# EAGLE design G785E (EAGLE 6.6.0)
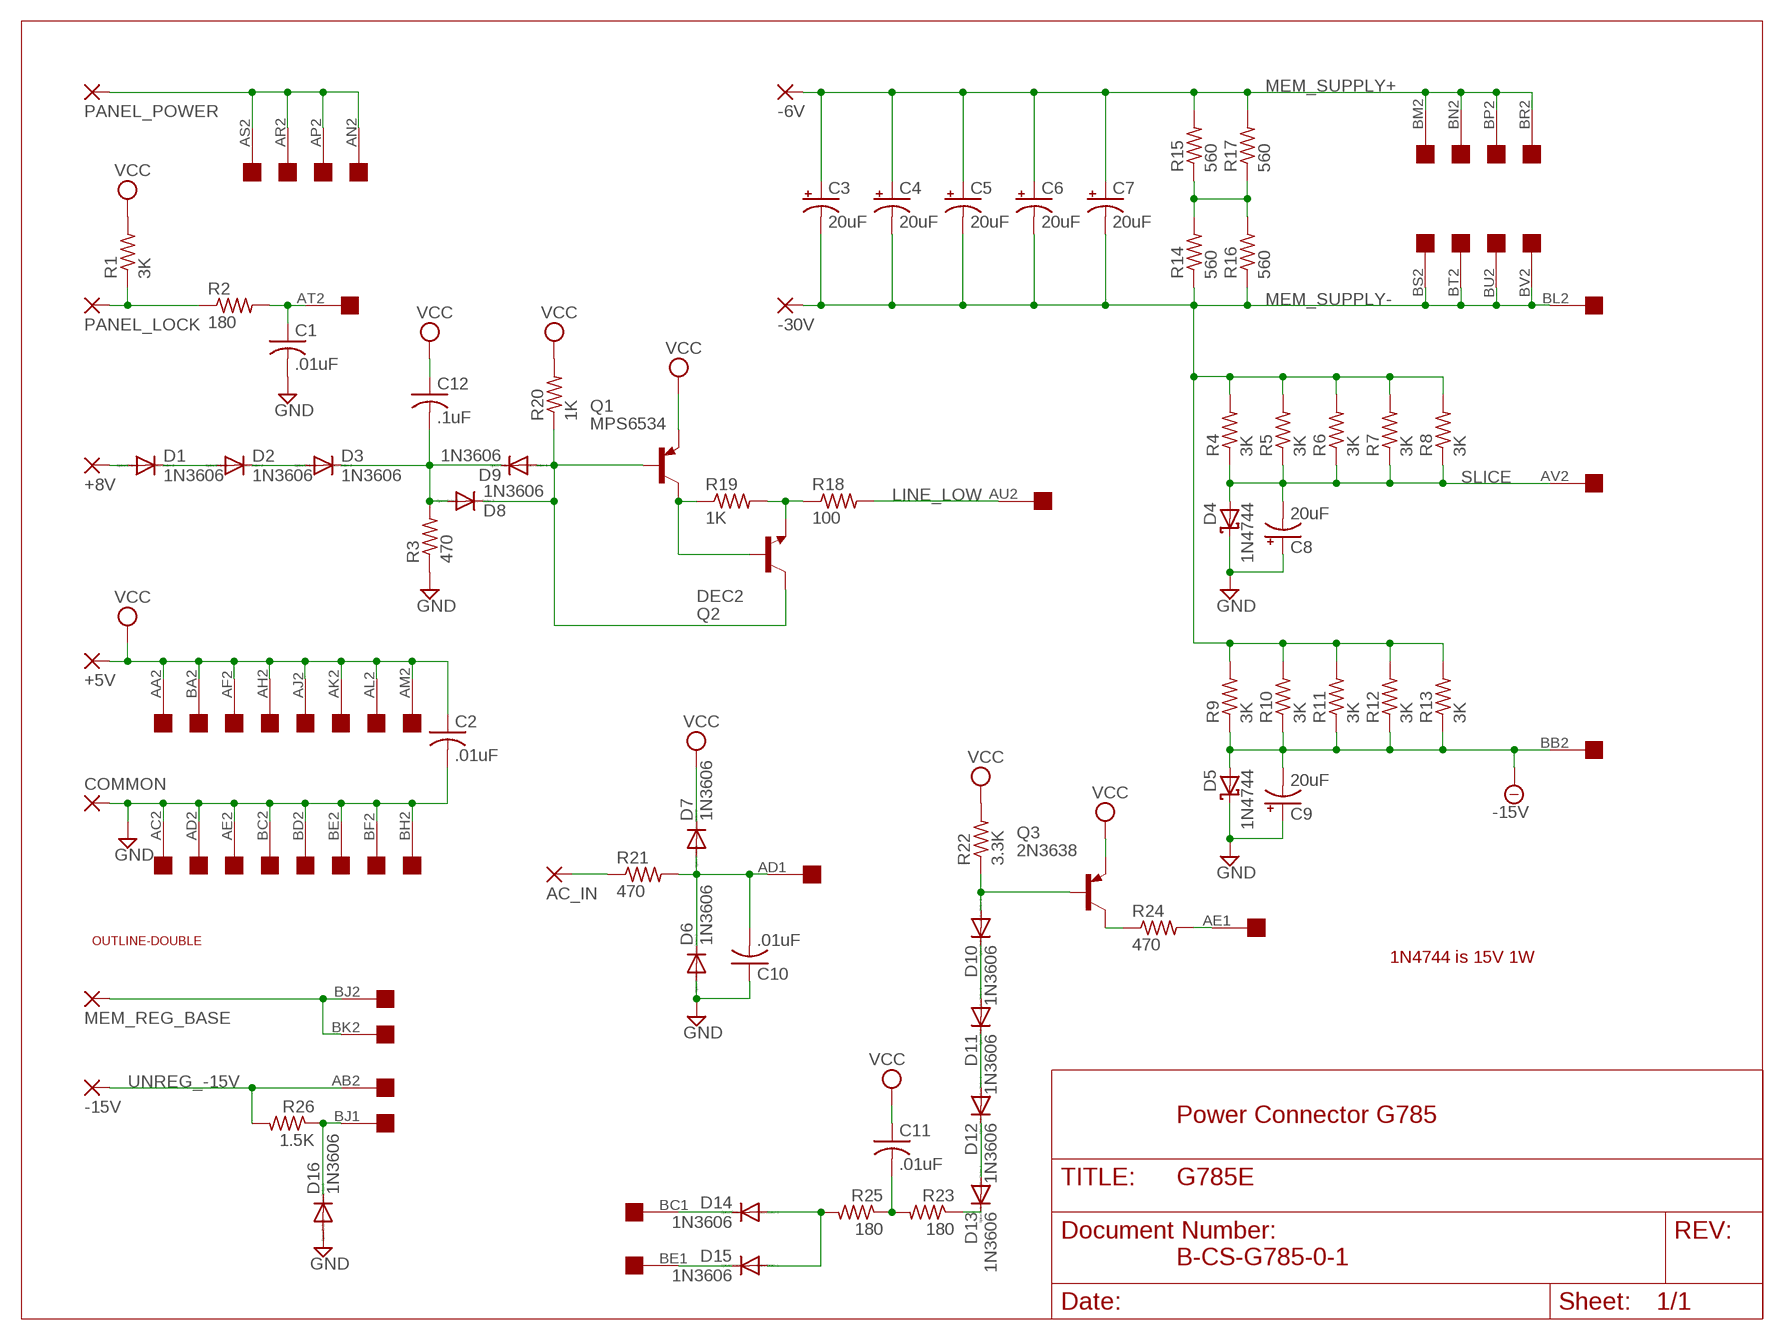
[diagram p0: schematic, sheet 1]

## Parts
+5V  3,81/1,4  [3,81/1,4]
+8V  3,81/1,4  [3,81/1,4]
-6V  3,81/1,4  [3,81/1,4]
-15V  3,81/1,4  [3,81/1,4]
-30V  3,81/1,4  [3,81/1,4]
AC_IN  3,81/1,4  [3,81/1,4]
C1  .01uF  C-US050-025X075  [C050-025X075]
C2  .01uF  C-US050-025X075  [C050-025X075]
C3  20uF  CPOL-USE25-9AXIAL  [E25-9]
C4  20uF  CPOL-USE25-9AXIAL  [E25-9]
C5  20uF  CPOL-USE25-9AXIAL  [E25-9]
C6  20uF  CPOL-USE25-9AXIAL  [E25-9]
C7  20uF  CPOL-USE25-9AXIAL  [E25-9]
C8  20uF  CPOL-USE25-9AXIAL  [E25-9]
C9  20uF  CPOL-USE25-9AXIAL  [E25-9]
C10  .01uF  C-US050-025X075  [C050-025X075]
C11  .01uF  C-US050-025X075  [C050-025X075]
C12  .1uF  C-US102-043X133  [C102-043X133]
COMMON  3,81/1,4  [3,81/1,4]
D1  1N3606  1N4148DO35-10  [DO35-10]
D2  1N3606  1N4148DO35-10  [DO35-10]
D3  1N3606  1N4148DO35-10  [DO35-10]
D4  1N4744  BAT42  [DO35-10]
D5  1N4744  BAT42  [DO35-10]
D6  1N3606  1N4148DO35-10  [DO35-10]
D7  1N3606  1N4148DO35-10  [DO35-10]
D8  1N3606  1N4148DO35-10  [DO35-10]
D9  1N3606  1N4148DO35-10  [DO35-10]
D10  1N3606  1N4148DO35-10  [DO35-10]
D11  1N3606  1N4148DO35-10  [DO35-10]
D12  1N3606  1N4148DO35-10  [DO35-10]
D13  1N3606  1N4148DO35-10  [DO35-10]
D14  1N3606  1N4148DO35-10  [DO35-10]
D15  1N3606  1N4148DO35-10  [DO35-10]
D16  1N3606  1N4148DO35-10  [DO35-10]
MEM_REG_BASE  3,81/1,4  [3,81/1,4]
PANEL_LOCK  3,81/1,4  [3,81/1,4]
PANEL_POWER  3,81/1,4  [3,81/1,4]
Q1  MPS6534  2N2904  [TO39]
Q2  DEC2  2N2219  [TO5]
Q3  2N3638  2N2904  [TO39]
R1  3K  R-US_0207/10  [0207/10]
R2  180  R-US_0207/10  [0207/10]
R3  470  R-US_0207/10  [0207/10]
R4  3K  R-US_0207/10  [0207/10]
R5  3K  R-US_0207/10  [0207/10]
R6  3K  R-US_0207/10  [0207/10]
R7  3K  R-US_0207/10  [0207/10]
R8  3K  R-US_0207/10  [0207/10]
R9  3K  R-US_0207/10  [0207/10]
R10  3K  R-US_0207/10  [0207/10]
R11  3K  R-US_0207/10  [0207/10]
R12  3K  R-US_0207/10  [0207/10]
R13  3K  R-US_0207/10  [0207/10]
R14  560  R-US_0207/10  [0207/10]
R15  560  R-US_0207/10  [0207/10]
R16  560  R-US_0207/10  [0207/10]
R17  560  R-US_0207/10  [0207/10]
R18  100  R-US_0207/10  [0207/10]
R19  1K  R-US_0207/10  [0207/10]
R20  1K  R-US_0207/10  [0207/10]
R21  470  R-US_0207/10  [0207/10]
R22  3.3K  R-US_0207/10  [0207/10]
R23  180  R-US_0207/10  [0207/10]
R24  470  R-US_0207/10  [0207/10]
R25  180  R-US_0207/10  [0207/10]
R26  1.5K  R-US_0207/10  [0207/10]
U$1  DOUBLE  [EDGE-CON4]
U$2  OUTLINE-DOUBLE  [DOUBLE]

## Nets
-15V: C9.- D5.A R9.1 R10.1 R11.1 R12.1 R13.1 U$1.BB2
GND: C1.2 C2.2 C8.+ C9.+ C10.1 COMMON.1(P) D4.C D5.C D6.A D16.A R3.1 U$1.AC2 U$1.AD2 U$1.AE2 U$1.BC2 U$1.BD2 U$1.BE2 U$1.BF2 U$1.BH2
LINE_LOW: R18.2 U$1.AU2
MEM_SUPPLY+: -6V.1(P) C3.+ C4.+ C5.+ C6.+ C7.+ R15.2 R17.2 U$1.BM2 U$1.BN2 U$1.BP2 U$1.BR2
MEM_SUPPLY-: -30V.1(P) C3.- C4.- C5.- C6.- C7.- R4.2 R5.2 R6.2 R7.2 R8.2 R9.2 R10.2 R11.2 R12.2 R13.2 R14.1 R16.1 U$1.BL2 U$1.BS2 U$1.BT2 U$1.BU2 U$1.BV2
N$1: PANEL_LOCK.1(P) R1.1 R2.1
N$2: C1.1 R2.2 U$1.AT2
N$3: +8V.1(P) D1.A
N$4: D1.C D2.A
N$5: D2.C D3.A
N$6: D8.C D9.A Q1.2(B) Q2.3(C) R20.1
N$7: D14.C U$1.BC1
N$8: Q1.3(C) Q2.2(B) R19.1
N$9: Q2.1(E) R18.1 R19.2
N$10: MEM_REG_BASE.1(P) U$1.BJ2 U$1.BK2
N$11: R14.2 R15.1 R16.2 R17.1
N$12: AC_IN.1(P) R21.1
N$13: C10.2 D6.C D7.A R21.2 U$1.AD1
N$14: D10.A Q3.2(B) R22.1
N$15: Q3.3(C) R24.1
N$16: C11.2 R23.2 R25.1
N$17: D14.A D15.A R25.2
N$18: C12.2 D3.C D8.A D9.C R3.2
N$20: D13.C R23.1
N$21: D16.C R26.1 U$1.BJ1
N$22: D15.C U$1.BE1
N$23: D10.C D11.A
N$25: R24.2 U$1.AE1
N$26: D11.C D12.A
N$29: D12.C D13.A
PANEL_POWER: PANEL_POWER.1(P) U$1.AN2 U$1.AP2 U$1.AR2 U$1.AS2
SLICE: C8.- D4.A R4.1 R5.1 R6.1 R7.1 R8.1 U$1.AV2
UNREG_-15V: -15V.1(P) R26.2 U$1.AB2
VCC: +5V.1(P) C2.1 C11.1 C12.1 D7.C Q1.1(E) Q3.1(E) R1.2 R20.2 R22.2 U$1.AA2 U$1.AF2 U$1.AH2 U$1.AJ2 U$1.AK2 U$1.AL2 U$1.AM2 U$1.BA2
Unconnected: U$1.AA1 U$1.AB1 U$1.AC1 U$1.AF1 U$1.AH1 U$1.AJ1 U$1.AK1 U$1.AL1 U$1.AM1 U$1.AN1 U$1.AP1 U$1.AR1 U$1.AS1 U$1.AT1 U$1.AU1 U$1.AV1 U$1.BA1 U$1.BB1 U$1.BD1 U$1.BF1 U$1.BH1 U$1.BK1 U$1.BL1 U$1.BM1 U$1.BN1 U$1.BP1 U$1.BR1 U$1.BS1 U$1.BT1 U$1.BU1 U$1.BV1

## Notes on the sheet
- 1N4744 is 15V 1W
- Power Connector G785
- B-CS-G785-0-1

## Library data of the parts
+5V +8V -6V -15V -30V AC_IN COMMON MEM_REG_BASE PANEL_LOCK PANEL_POWER = wirepad:3,81/1,4: THROUGH-HOLE PAD
C1 C2 C10-C12 = rcl:C-US: CAPACITOR, American symbol
C3-C9 = rcl:CPOL-US: POLARIZED CAPACITOR, American symbol
D1-D3 D6-D16 = diode:1N4148: DIODE high speed (Philips)
D4 D5 = diode:BAT42: DIODE barrier diode
Q1 Q3 = transistor-pnp:2N2904*: PNP Transistror
Q2 = transistor-npn:2N2219: NPN Transistor
R1-R26 = rcl:R-US_: RESISTOR, American symbol
U$1 = dec-con:DOUBLE: Double-Height DEC board
U$2 = dec-con:OUTLINE-*: Board outlines for DEC boards.

## Board
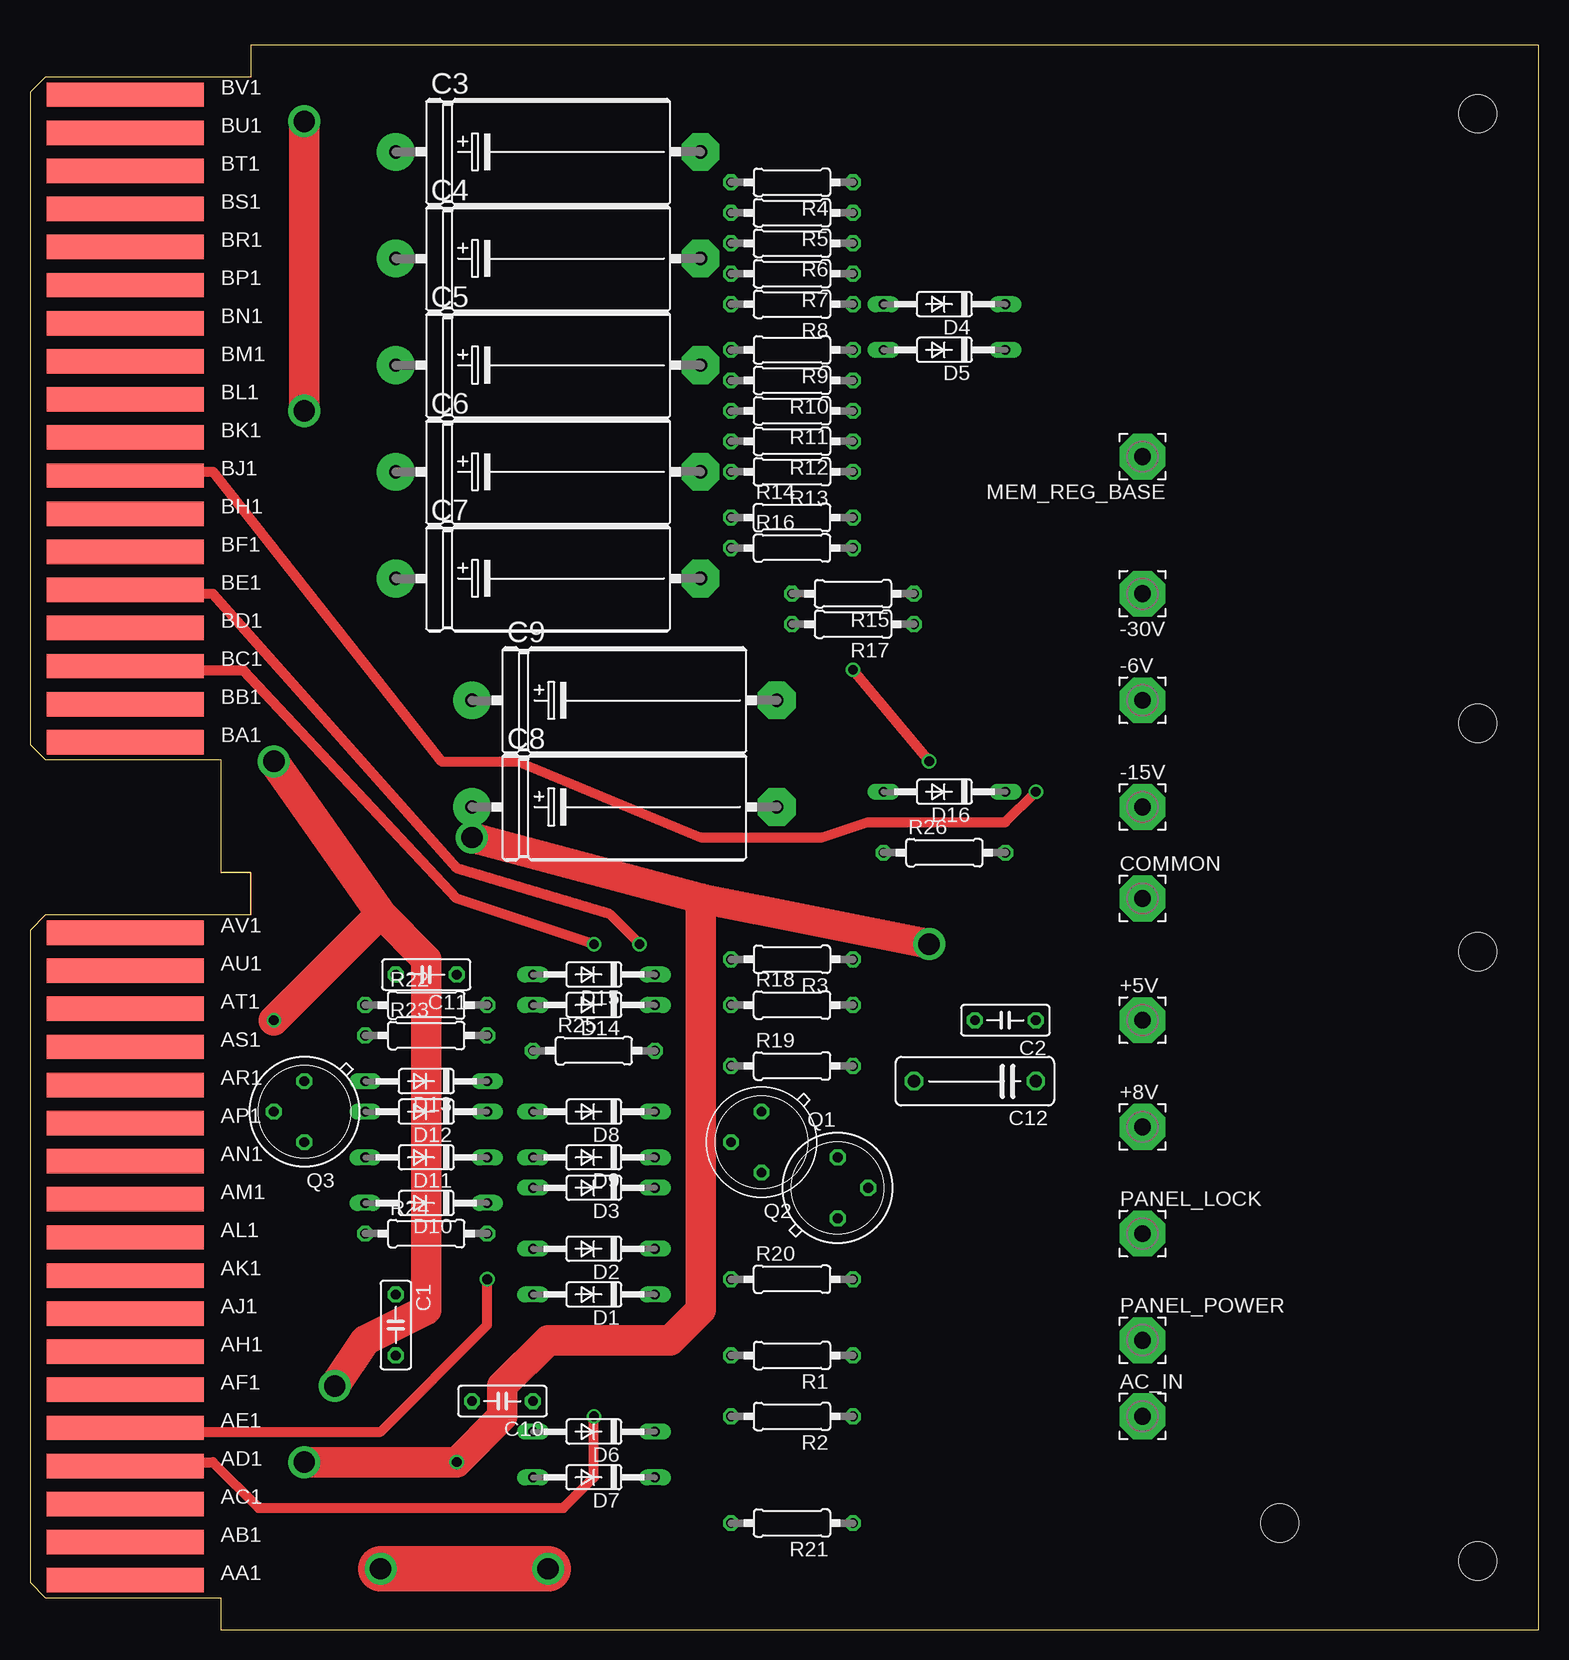
[diagram p1: board, top side]
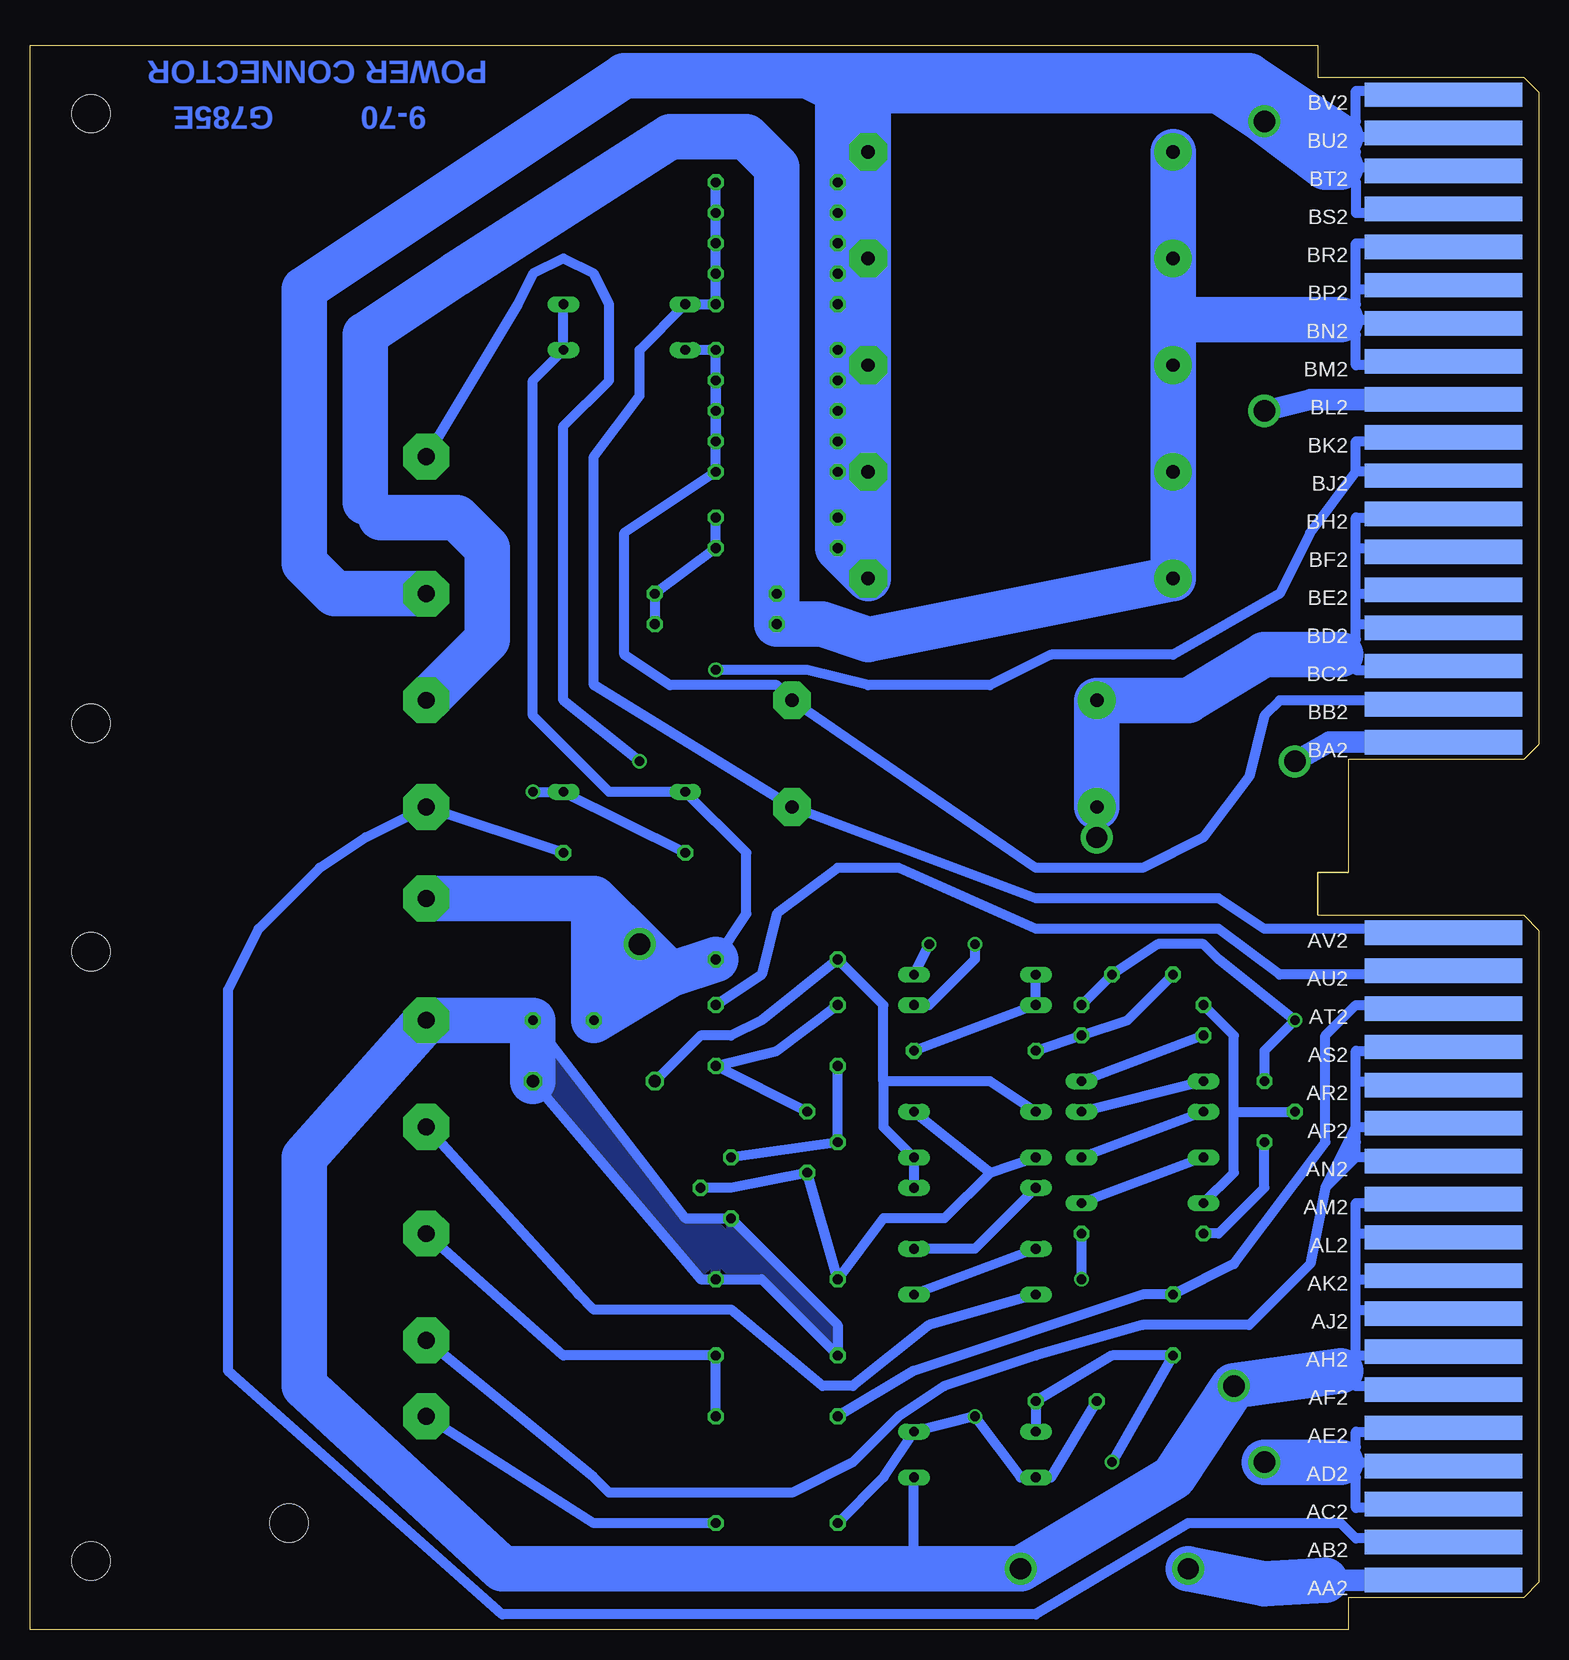
[diagram p2: board, bottom side, seen from below]

Size 125.73 x 132.08 mm. Coordinates in mm from the lower left corner, seen from the top.
Copper layers (1+16): Top 0.035mm / dielectric 1.5mm / Bottom 0.035mm
Design rules "16mils": minimum track width 16mil, minimum drill 32mil, track to track 15mil, track to pad 10mil, pad to pad 10mil, via to via 10mil, smd to smd 10mil, copper to edge 13mil, drill to drill 10mil, minimum pad ring 10mil, minimum via ring 8mil, stop-mask expansion 0mil, vias tented up to drill 0mil, thermal gap 10mil
Holes 3.17 mm at 104.14,8.89

### Footprints (pad centres in the part's own frame; a part is rotated, then mirrored left to right if it is on the bottom)
3,81/1,4 = drill 1.397 pad 3.81 octagon: 1 0,0
C050-025X075 = drill 0.813 octagon: 1 -2.54,0; 2 2.54,0
E25-9 = drill 1.118 pad 3.15: + -12.7,0 | drill 1.118 pad 3.15 octagon: - 12.7,0
C102-043X133 = drill 1.016 octagon: 1 -5.08,0; 2 5.08,0
DO35-10 = drill 0.813 long: A 5.08,0; C -5.08,0
TO39 = drill 0.813 octagon: 1 0,-2.54; 2 2.54,0; 3 0,2.54
TO5 = drill 0.813 octagon: 1 0,-2.54; 2 2.54,0; 3 0,2.54
0207/10 = drill 0.813 octagon: 1 -5.08,0; 2 5.08,0
EDGE-CON4 = smd 13.106 x 2.032: AA1 7.938,4.128; AB1 7.938,7.303; AC1 7.938,10.477; AD1 7.938,13.652; AE1 7.938,16.828; AF1 7.938,20.003; AH1 7.938,23.177; AJ1 7.938,26.352; AK1 7.938,29.527; AL1 7.938,32.703; AM1 7.938,35.877; AN1 7.938,39.053; AP1 7.938,42.227; AR1 7.938,45.403; AS1 7.938,48.578; AT1 7.938,51.752; AU1 7.938,54.928; AV1 7.938,58.102; BA1 7.938,73.978; BB1 7.938,77.153; BC1 7.938,80.328; BD1 7.938,83.502; BE1 7.938,86.677; BF1 7.938,89.853; BH1 7.938,93.028; BJ1 7.938,96.203; BK1 7.938,99.377; BL1 7.938,102.552; BM1 7.938,105.728; BN1 7.938,108.903; BP1 7.938,112.078; BR1 7.938,115.252; BS1 7.938,118.427; BT1 7.938,121.603; BU1 7.938,124.778; BV1 7.938,127.953 | smd 13.106 x 2.032 bottom: AA2 7.938,4.128; AB2 7.938,7.303; AC2 7.938,10.477; AD2 7.938,13.652; AE2 7.938,16.828; AF2 7.938,20.003; AH2 7.938,23.177; AJ2 7.938,26.352; AK2 7.938,29.527; AL2 7.938,32.703; AM2 7.938,35.877; AN2 7.938,39.053; AP2 7.938,42.227; AR2 7.938,45.403; AS2 7.938,48.578; AT2 7.938,51.752; AU2 7.938,54.928; AV2 7.938,58.102; BA2 7.938,73.978; BB2 7.938,77.153; BC2 7.938,80.328; BD2 7.938,83.502; BE2 7.938,86.677; BF2 7.938,89.853; BH2 7.938,93.028; BJ2 7.938,96.203; BK2 7.938,99.377; BL2 7.938,102.552; BM2 7.938,105.728; BN2 7.938,108.903; BP2 7.938,112.078; BR2 7.938,115.252; BS2 7.938,118.427; BT2 7.938,121.603; BU2 7.938,124.778; BV2 7.938,127.953
DOUBLE = hole 3.175: 120.65,56.515; 120.65,5.715; 120.65,75.565; 120.65,126.365

### Placement (x,y rotation side)
+5V  92.71,50.8 0 top
+8V  92.71,41.91 0 top
-6V  92.71,77.47 0 top
-15V  92.71,68.58 0 top
-30V  92.71,86.36 180 top
AC_IN  92.71,17.78 0 top
C1  30.48,25.4 270 top
C2  81.28,50.8 180 top
C3  43.18,123.19 0 top
C4  43.18,114.3 0 top
C5  43.18,105.41 0 top
C6  43.18,96.52 0 top
C7  43.18,87.63 0 top
C8  49.53,68.58 0 top
C9  49.53,77.47 0 top
C10  39.37,19.05 180 top
C11  33.02,54.61 180 top
C12  78.74,45.72 180 top
COMMON  92.71,60.96 0 top
D1  46.99,27.94 180 top
D2  46.99,31.75 180 top
D3  46.99,36.83 180 top
D4  76.2,110.49 180 top
D5  76.2,106.68 180 top
D6  46.99,16.51 180 top
D7  46.99,12.7 180 top
D8  46.99,43.18 180 top
D9  46.99,39.37 180 top
D10  33.02,35.56 180 top
D11  33.02,39.37 180 top
D12  33.02,43.18 180 top
D13  33.02,45.72 180 top
D14  46.99,52.07 180 top
D15  46.99,54.61 180 top
D16  76.2,69.85 180 top
MEM_REG_BASE  92.71,97.79 180 top
PANEL_LOCK  92.71,33.02 0 top
PANEL_POWER  92.71,24.13 0 top
Q1  67.31,36.83 0 top
Q2  60.96,40.64 180 top
Q3  22.86,43.18 180 top
R1  63.5,22.86 180 top
R2  63.5,17.78 180 top
R3  63.5,55.88 180 top
R4  63.5,120.65 180 top
R5  63.5,118.11 180 top
R6  63.5,115.57 180 top
R7  63.5,113.03 180 top
R8  63.5,110.49 180 top
R9  63.5,106.68 180 top
R10  63.5,104.14 180 top
R11  63.5,101.6 180 top
R12  63.5,99.06 180 top
R13  63.5,96.52 180 top
R14  63.5,92.71 0 top
R15  68.58,86.36 180 top
R16  63.5,90.17 0 top
R17  68.58,83.82 180 top
R18  63.5,52.07 0 top
R19  63.5,46.99 0 top
R20  63.5,29.21 0 top
R21  63.5,8.89 180 top
R22  33.02,52.07 0 top
R23  33.02,49.53 0 top
R24  33.02,33.02 0 top
R25  46.99,48.26 0 top
R26  76.2,64.77 0 top
U$1  0,0 0 top
U$2  0,0 0 top

### Tracks (layer width: path | path; a pad name or v marks a point on that pad's centre or on a via)
-15V
  Bottom 0.813: U$1.BB2 8.89,77.47 21.59,77.47 22.86,76.2 24.13,71.12 27.94,66.04 33.02,63.5 41.91,63.5 C9.- 63.5,78.74 72.39,78.74 76.2,81.28 76.2,91.44 R13.1 | R13.1 R10.1 R12.1 R13.1 | R13.1 R11.1 R9.1 D5.A
GND  (via drill 0.81, 1.78)
  Top 2.54: v22.86,13.97 v35.56,13.97 39.37,17.78 39.37,20.32 43.18,24.13 53.34,24.13 55.88,26.67 55.88,60.96 | 55.88,60.96 v36.83,66.04 | 55.88,60.96 v74.93,57.15
  Bottom 0.813: D4.C D5.C 83.82,104.14 83.82,76.2 77.47,69.85 D16.A 66.04,64.77 66.04,59.69 R3.1 | U$1.AC2 8.89,10.16 15.24,10.16 15.24,12.7 16.51,13.97 | 16.51,13.97 15.24,15.24 15.24,16.51 8.89,16.51 U$1.AE2 | U$1.AD2 8.89,13.97 16.51,13.97 | v35.56,13.97 C1.2 35.56,22.86 C10.1 | U$1.BH2 8.89,92.71 15.24,92.71 15.24,90.17 | 15.24,83.82 15.24,82.55 16.51,81.28 15.24,80.01 8.89,80.01 U$1.BC2 | 15.24,83.82 15.24,86.36 | 15.24,86.36 15.24,90.17 | U$1.BD2 8.89,83.82 15.24,83.82 | U$1.BE2 8.89,86.36 15.24,86.36 | U$1.BF2 8.89,90.17 15.24,90.17 | C10.1 D6.A C10.1 | v36.83,66.04 C8.+
  Bottom 3.81: 16.51,13.97 v22.86,13.97 | 78.74,60.96 COMMON.1 | v74.93,57.15 72.39,54.61 | v74.93,57.15 78.74,60.96 | 72.39,54.61 R3.1 | 16.51,81.28 22.86,81.28 29.21,77.47 C9.+ C8.+ | 72.39,54.61 C2.2 | 78.74,60.96 C2.2 | v74.93,57.15 C2.2
LINE_LOW
  Bottom 0.813: U$1.AU2 8.89,54.61 21.59,54.61 26.67,58.42 41.91,58.42 53.34,63.5 58.42,63.5 63.5,59.69 64.77,54.61 R18.2
MEM_SUPPLY+
  Bottom 0.813: U$1.BR2 8.89,115.57 15.24,115.57 15.24,111.76 | 16.51,109.22 15.24,107.95 15.24,105.41 8.89,105.41 U$1.BM2 | 16.51,109.22 15.24,110.49 15.24,111.76 | U$1.BN2 8.89,109.22 16.51,109.22 | U$1.BP2 8.89,111.76 15.24,111.76 | 97.79,93.98 96.52,92.71
  Bottom 3.81: C3.+ C4.+ 30.48,109.22 | 30.48,109.22 C5.+ C6.+ C7.+ 55.88,82.55 59.69,83.82 R17.2 R15.2 63.5,121.92 66.04,124.46 72.39,124.46 90.17,113.03 97.79,107.95 97.79,93.98 | 16.51,109.22 30.48,109.22 | -6V.1 87.63,82.55 87.63,90.17 90.17,92.71 96.52,92.71
MEM_SUPPLY-  (via drill 1.78)
  Top 2.54: v22.86,101.6 v22.86,125.73
  Bottom 0.813: C3.- R4.2 | U$1.BS2 8.89,118.11 15.24,118.11 15.24,120.65 16.51,121.92 | 16.51,121.92 15.24,121.92 15.24,123.19 16.51,124.46 | 16.51,124.46 15.24,125.73 15.24,128.27 8.89,128.27 U$1.BV2 | U$1.BU2 8.89,124.46 16.51,124.46 | U$1.BT2 8.89,121.92 16.51,121.92 | 54.61,128.27 54.61,87.63 C7.- | U$1.BL2 8.89,102.55
  Bottom 1.778: 8.89,102.55 19.05,102.55 v22.86,101.6
  Bottom 3.81: -30V.1 100.33,86.36 102.87,88.9 102.87,111.76 76.2,129.54 60.96,129.54 | 60.96,129.54 55.88,127 C3.- C4.- C5.- C6.- C7.- R16.1 R14.1 R13.2 R12.2 R11.2 R10.2 R9.2 R8.2 R7.2 R6.2 R5.2 R4.2 58.42,129.54 | 16.51,124.46 24.13,129.54 58.42,129.54 | 58.42,129.54 60.96,129.54 | 16.51,121.92 17.78,121.92 v22.86,125.73 26.67,128.27 54.61,128.27
N$1
  Bottom 0.813: R2.1 R1.1 81.28,22.86 PANEL_LOCK.1
N$2
  Bottom 0.813: U$1.AT2 8.89,52.07 15.24,52.07 17.78,49.53 17.78,40.64 25.4,30.48 C1.1 33.02,27.94 52.07,21.59 R2.2
N$3
  Bottom 0.813: +8V.1 80.01,27.94 78.74,26.67 67.31,26.67 59.69,20.32 57.15,20.32 50.8,25.4 D1.A
N$4
  Bottom 0.813: D2.A D1.C
N$5
  Bottom 0.813: D3.A 46.99,31.75 D2.C
N$6
  Bottom 0.813: 45.72,38.1 49.53,34.29 54.61,34.29 R20.1 Q2.3 67.31,36.83 Q1.2 | D9.A 45.72,38.1 | 45.72,38.1 D8.C
N$7  (via drill 0.81)
  Top 0.813: U$1.BC1 8.89,80.01 17.78,80.01 35.56,60.96 v46.99,57.15
  Bottom 0.813: D14.C 50.8,52.07 46.99,55.88 v46.99,57.15
N$8
  Bottom 0.813: Q1.3 Q2.2 R19.1
N$9
  Bottom 0.813: R18.1 63.5,48.26 R19.2 Q2.1
N$10  (via drill 0.81)
  Top 0.813: v68.58,80.01 v74.93,72.39
  Bottom 0.813: MEM_REG_BASE.1 85.09,110.49 83.82,113.03 81.28,114.3 78.74,113.03 77.47,110.49 77.47,104.14 81.28,100.33 81.28,77.47 v74.93,72.39 | U$1.BK2 8.89,99.06 15.24,99.06 15.24,96.52 | 15.24,96.52 8.89,96.52 U$1.BJ2 | 15.24,96.52 19.05,91.44 21.59,86.36 30.48,81.28 40.64,81.28 45.72,78.74 55.88,78.74 60.96,80.01 v68.58,80.01
N$11
  Bottom 0.813: R14.2 R16.2 R15.1 R17.1
N$12
  Bottom 0.813: AC_IN.1 78.74,8.89 R21.1
N$13  (via drill 0.81)
  Top 0.813: U$1.AD1 8.89,13.97 15.24,13.97 19.05,10.16 44.45,10.16 46.99,12.7 v46.99,17.78
  Bottom 0.813: R21.2 54.61,12.7 D6.C v46.99,17.78 43.18,12.7 D7.A 40.64,12.7 C10.2
N$14
  Bottom 0.813: 25.4,43.18 Q3.2 | 25.4,43.18 25.4,49.53 R22.1 | 25.4,43.18 25.4,38.1 D10.A
N$15
  Bottom 0.813: Q3.3 22.86,36.83 26.67,33.02 R24.1
N$16
  Bottom 0.813: C11.2 34.29,50.8 R23.2 R25.1
N$17
  Bottom 0.813: R25.2 D14.A D15.A
N$18
  Bottom 0.813: C12.2 69.85,49.53 67.31,49.53 64.77,50.8 R3.2 54.61,52.07 54.61,45.72 | 54.61,45.72 45.72,45.72 D8.A | 54.61,45.72 54.61,41.91 D9.C D3.C
N$20
  Bottom 0.813: R23.1 D13.C
N$21  (via drill 0.81)
  Top 0.813: v83.82,69.85 81.28,67.31 69.85,67.31 66.04,66.04 55.88,66.04 40.64,72.39 34.29,72.39 15.24,96.52 8.89,96.52 U$1.BJ1
  Bottom 0.813: R26.1 D16.C v83.82,69.85
N$22  (via drill 0.81)
  Top 0.813: U$1.BE1 8.89,86.36 15.24,86.36 35.56,63.5 48.26,59.69 v50.8,57.15
  Bottom 0.813: v50.8,57.15 D15.C
N$23
  Bottom 0.813: D11.A D10.C
N$25  (via drill 0.81)
  Top 0.813: U$1.AE1 8.89,16.51 29.21,16.51 38.1,25.4 v38.1,29.21
  Bottom 0.813: v38.1,29.21 R24.2
N$26
  Bottom 0.813: D12.A D11.C
N$29
  Bottom 0.813: D13.A D12.C
PANEL_POWER
  Bottom 0.813: PANEL_POWER.1 78.74,12.7 77.47,11.43 62.23,11.43 57.15,13.97 53.34,17.78 49.53,20.32 41.91,22.86 33.02,25.4 24.13,25.4 19.05,30.48 17.78,36.83 | U$1.AN2 8.89,39.37 15.24,39.37 | 15.24,39.37 17.78,36.83 | U$1.AS2 8.89,48.26 15.24,48.26 15.24,45.72 | 15.24,39.37 15.24,40.64 | 15.24,40.64 15.24,41.91 | 15.24,41.91 15.24,45.72 | U$1.AP2 8.89,41.91 15.24,41.91 | U$1.AR2 8.89,45.72 15.24,45.72 | 17.78,36.83 15.24,40.64 | 17.78,36.83 15.24,41.91
SLICE
  Bottom 0.813: U$1.AV2 8.89,58.42 22.86,58.42 26.67,60.96 41.91,60.96 C8.- 78.74,78.74 78.74,97.79 74.93,102.87 74.93,106.68 D4.A R8.1 R7.1 R6.1 R5.1 R4.1
UNREG_-15V
  Bottom 0.813: R26.2 -15V.1 97.79,66.04 101.6,63.5 106.68,58.42 109.22,53.34 109.22,21.59 86.36,1.27 41.91,1.27 29.21,8.89 16.51,8.89 15.24,7.62 10.16,7.62 U$1.AB2
VCC  (via drill 0.81, 1.78)
  Top 2.54: 29.21,59.69 v20.32,72.39 | 29.21,59.69 33.02,55.88 33.02,26.67 27.94,24.13 v25.4,20.32 | 29.21,59.69 v20.32,50.8
  Top 3.81: v29.21,5.08 v43.18,5.08
  Bottom 0.813: U$1.AA2 8.89,4.13 | U$1.AM2 8.89,35.56 15.24,35.56 15.24,33.02 | 15.24,22.86 15.24,21.59 16.51,21.59 15.24,20.32 8.89,20.32 U$1.AF2 | 15.24,22.86 15.24,26.67 | 15.24,26.67 15.24,29.21 | 15.24,29.21 15.24,33.02 | U$1.AH2 8.89,22.86 15.24,22.86 | U$1.AJ2 8.89,26.67 15.24,26.67 | U$1.AK2 8.89,29.21 15.24,29.21 | U$1.AL2 8.89,33.02 15.24,33.02 | 8.57,73.98 U$1.BA2 | C2.1 71.12,34.29 Q1.1 58.42,25.4 R1.2 64.77,29.21 R20.2 69.85,29.21 C12.1 | 52.07,5.08 D7.C | Q3.1 22.86,48.26 v20.32,50.8 26.67,55.88 27.94,57.15 31.75,57.15 C11.1 R22.2
  Bottom 1.778: 8.89,4.13 17.78,4.13 | 8.57,73.98 17.46,73.98 v20.32,72.39
  Bottom 3.81: 17.78,4.13 22.86,3.81 v29.21,5.08 | 16.51,21.59 v25.4,20.32 30.48,12.7 v43.18,5.08 52.07,5.08 86.36,5.08 102.87,20.32 102.87,39.37 +5V.1 C2.1 C12.1
  pour Bottom: 58.42,22.86 58.42,25.4 67.31,34.29 71.12,34.29 83.82,50.8 83.82,45.72 69.85,29.21 64.77,29.21

### Text on the board
Bottom: POWER CONNECTOR | 9-70 | G785E